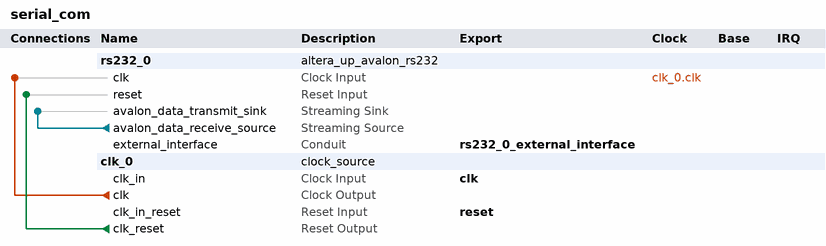
[diagram p0: system contents]
# Platform Designer (Qsys) system serial_com, Cyclone IV E EP4CE6E22C8
# Parameters at their usual value, and those the tool derives, are not listed.
package require -exact qsys 17.1
create_system serial_com
set_project_property DEVICE_FAMILY {Cyclone IV E}
set_project_property DEVICE EP4CE6E22C8

add_instance rs232_0 altera_up_avalon_rs232 17.1
set_instance_property rs232_0 AUTO_EXPORT true
set_instance_parameter_value rs232_0 avalon_bus_type Streaming
set_instance_parameter_value rs232_0 baud 115200
set_instance_parameter_value rs232_0 parity None

add_instance clk_0 clock_source 23.1
set_instance_parameter_value clk_0 clockFrequency 50000000
set_instance_parameter_value clk_0 resetSynchronousEdges BOTH

# connections
add_connection clk_0.clk rs232_0.clk clock
add_connection clk_0.clk_reset rs232_0.reset reset
add_connection rs232_0.avalon_data_receive_source rs232_0.avalon_data_transmit_sink avalon_streaming

# exported interfaces
add_interface clk clock sink
set_interface_property clk EXPORT_OF clk_0.clk_in
add_interface reset reset sink
set_interface_property reset EXPORT_OF clk_0.clk_in_reset
add_interface rs232_0_external_interface conduit end
set_interface_property rs232_0_external_interface EXPORT_OF rs232_0.external_interface

set_interconnect_requirement {$system} qsys_mm.clockCrossingAdapter HANDSHAKE
set_interconnect_requirement {$system} qsys_mm.enableEccProtection FALSE
set_interconnect_requirement {$system} qsys_mm.insertDefaultSlave FALSE
set_interconnect_requirement {$system} qsys_mm.maxAdditionalLatency 1

save_system serial_com.qsys
